# Altium schematic sheet Enconder_Part1.SchDoc
size A4
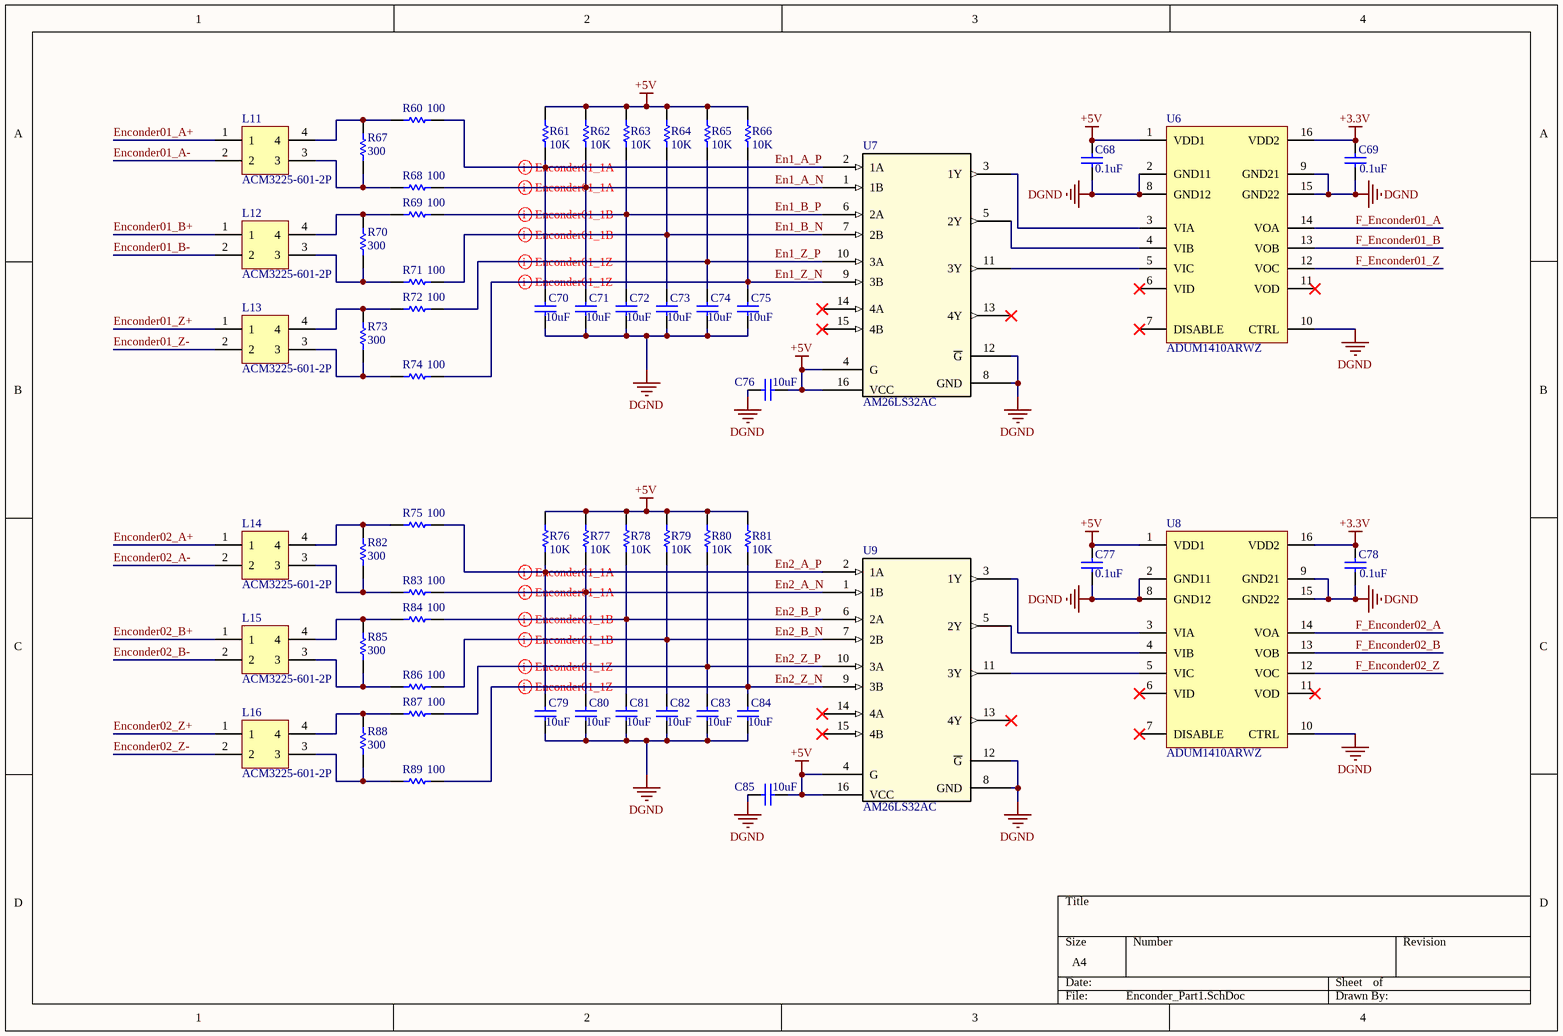
[diagram p0: Enconder_Part1.SchDoc]

## Parts
C68  value 0.1uF  [1608[0603]]  (hidden comment: Cap)
C69  value 0.1uF  [1608[0603]]  (hidden comment: Cap)
C70  value 10uF  [1608[0603]]  (hidden comment: Cap)
C71  value 10uF  [1608[0603]]  (hidden comment: Cap)
C72  value 10uF  [1608[0603]]  (hidden comment: Cap)
C73  value 10uF  [1608[0603]]  (hidden comment: Cap)
C74  value 10uF  [1608[0603]]  (hidden comment: Cap)
C75  value 10uF  [1608[0603]]  (hidden comment: Cap)
C76  value 10uF  [1608[0603]]  (hidden comment: Cap)
C77  value 0.1uF  [1608[0603]]  (hidden comment: Cap)
C78  value 0.1uF  [1608[0603]]  (hidden comment: Cap)
C79  value 10uF  [1608[0603]]  (hidden comment: Cap)
C80  value 10uF  [1608[0603]]  (hidden comment: Cap)
C81  value 10uF  [1608[0603]]  (hidden comment: Cap)
C82  value 10uF  [1608[0603]]  (hidden comment: Cap)
C83  value 10uF  [1608[0603]]  (hidden comment: Cap)
C84  value 10uF  [1608[0603]]  (hidden comment: Cap)
C85  value 10uF  [1608[0603]]  (hidden comment: Cap)
L11  ACM3225-601-2P  [ACM3225-601-2P]
L12  ACM3225-601-2P  [ACM3225-601-2P]
L13  ACM3225-601-2P  [ACM3225-601-2P]
L14  ACM3225-601-2P  [ACM3225-601-2P]
L15  ACM3225-601-2P  [ACM3225-601-2P]
L16  ACM3225-601-2P  [ACM3225-601-2P]
R60  value 100  [1608[0603]]  (hidden comment: Res1)
R61  value 10K  [1608[0603]]  (hidden comment: Res1)
R62  value 10K  [1608[0603]]  (hidden comment: Res1)
R63  value 10K  [1608[0603]]  (hidden comment: Res1)
R64  value 10K  [1608[0603]]  (hidden comment: Res1)
R65  value 10K  [1608[0603]]  (hidden comment: Res1)
R66  value 10K  [1608[0603]]  (hidden comment: Res1)
R67  value 300  [1608[0603]]  (hidden comment: Res1)
R68  value 100  [1608[0603]]  (hidden comment: Res1)
R69  value 100  [1608[0603]]  (hidden comment: Res1)
R70  value 300  [1608[0603]]  (hidden comment: Res1)
R71  value 100  [1608[0603]]  (hidden comment: Res1)
R72  value 100  [1608[0603]]  (hidden comment: Res1)
R73  value 300  [1608[0603]]  (hidden comment: Res1)
R74  value 100  [1608[0603]]  (hidden comment: Res1)
R75  value 100  [1608[0603]]  (hidden comment: Res1)
R76  value 10K  [1608[0603]]  (hidden comment: Res1)
R77  value 10K  [1608[0603]]  (hidden comment: Res1)
R78  value 10K  [1608[0603]]  (hidden comment: Res1)
R79  value 10K  [1608[0603]]  (hidden comment: Res1)
R80  value 10K  [1608[0603]]  (hidden comment: Res1)
R81  value 10K  [1608[0603]]  (hidden comment: Res1)
R82  value 300  [1608[0603]]  (hidden comment: Res1)
R83  value 100  [1608[0603]]  (hidden comment: Res1)
R84  value 100  [1608[0603]]  (hidden comment: Res1)
R85  value 300  [1608[0603]]  (hidden comment: Res1)
R86  value 100  [1608[0603]]  (hidden comment: Res1)
R87  value 100  [1608[0603]]  (hidden comment: Res1)
R88  value 300  [1608[0603]]  (hidden comment: Res1)
R89  value 100  [1608[0603]]  (hidden comment: Res1)
U6  ADUM1410ARWZ  [ADUM1410ARWZ_SOIC]
U7  AM26LS32AC  [AM26LS32AC_SOP]
U8  ADUM1410ARWZ  [ADUM1410ARWZ_SOIC]
U9  AM26LS32AC  [AM26LS32AC_SOP]

## Nets
+3.3V: C69.2 C78.2 U6.16(VDD2) U8.16(VDD2)
+5V: C68.2 C76.1 C77.2 C85.1 R61.2 R62.2 R63.2 R64.2 R65.2 R66.2 R76.2 R77.2 R78.2 R79.2 R80.2 R81.2 U6.1(VDD1) U7.4(G) U7.16(VCC) U8.1(VDD1) U9.4(G) U9.16(VCC)
DGND: C68.1 C69.1 C70.1 C71.1 C72.1 C73.1 C74.1 C75.1 C76.2 C77.1 C78.1 C79.1 C80.1 C81.1 C82.1 C83.1 C84.1 C85.2 U6.2(GND11) U6.8(GND12) U6.9(GND21) U6.10(CTRL) U6.15(GND22) U7.8(GND) U7.12(~{G}) U8.2(GND11) U8.8(GND12) U8.9(GND21) U8.10(CTRL) U8.15(GND22) U9.8(GND) U9.12(~{G})
En1_A_N: C71.2 R62.1 R68.2 U7.1(1B)
En1_A_P: C70.2 R60.2 R61.1 U7.2(1A)
En1_B_N: C73.2 R64.1 R71.2 U7.7(2B)
En1_B_P: C72.2 R63.1 R69.2 U7.6(2A)
En1_Z_N: C75.2 R66.1 R74.2 U7.9(3B)
En1_Z_P: C74.2 R65.1 R72.2 U7.10(3A)
En2_A_N: C80.2 R77.1 R83.2 U9.1(1B)
En2_A_P: C79.2 R75.2 R76.1 U9.2(1A)
En2_B_N: C82.2 R79.1 R86.2 U9.7(2B)
En2_B_P: C81.2 R78.1 R84.2 U9.6(2A)
En2_Z_N: C84.2 R81.1 R89.2 U9.9(3B)
En2_Z_P: C83.2 R80.1 R87.2 U9.10(3A)
Enconder01_A+: L11.1
Enconder01_A-: L11.2
Enconder01_B+: L12.1
Enconder01_B-: L12.2
Enconder01_Z+: L13.1
Enconder01_Z-: L13.2
Enconder02_A+: L14.1
Enconder02_A-: L14.2
Enconder02_B+: L15.1
Enconder02_B-: L15.2
Enconder02_Z+: L16.1
Enconder02_Z-: L16.2
F_Enconder01_A: U6.14(VOA)
F_Enconder01_B: U6.13(VOB)
F_Enconder01_Z: U6.12(VOC)
F_Enconder02_A: U8.14(VOA)
F_Enconder02_B: U8.13(VOB)
F_Enconder02_Z: U8.12(VOC)
NetL11_3: L11.3 R67.1 R68.1
NetL11_4: L11.4 R60.1 R67.2
NetL12_3: L12.3 R70.1 R71.1
NetL12_4: L12.4 R69.1 R70.2
NetL13_3: L13.3 R73.1 R74.1
NetL13_4: L13.4 R72.1 R73.2
NetL14_3: L14.3 R82.1 R83.1
NetL14_4: L14.4 R75.1 R82.2
NetL15_3: L15.3 R85.1 R86.1
NetL15_4: L15.4 R84.1 R85.2
NetL16_3: L16.3 R88.1 R89.1
NetL16_4: L16.4 R87.1 R88.2
NetU6_3: U6.3(VIA) U7.3(1Y)
NetU6_4: U6.4(VIB) U7.5(2Y)
NetU6_5: U6.5(VIC) U7.11(3Y)
NetU8_3: U8.3(VIA) U9.3(1Y)
NetU8_4: U8.4(VIB) U9.5(2Y)
NetU8_5: U8.5(VIC) U9.11(3Y)

Not connected (* = marked no-connect by the designer): U6 6(VID)* 7(DISABLE)* 11(VOD)*; U7 13(4Y)* 14(4A)* 15(4B)*; U8 6(VID)* 7(DISABLE)* 11(VOD)*; U9 13(4Y)* 14(4A)* 15(4B)*

## Layout directives
differential pair: En1_A_N, En1_A_P, En1_B_N, En1_B_P, En1_Z_N, En1_Z_P, En2_A_N, En2_A_P, En2_B_N, En2_B_P, En2_Z_N, En2_Z_P

## Library data of the parts
C68-C85 = Cap: Capacitor; Published: 8-Jun-2000; LatestRevisionDate: 17-Jul-2002; LatestRevisionNote: Re-released for DXP Platform.; PackageReference: RAD-0.3; Publisher: Altium Limited; PackageDescription: Radial Cap, Thru-Hole; 2 Leads; 0.3 in Pin Spacing
R60-R89 = Res1: Resistor; Published: 8-Jun-2000; LatestRevisionDate: 17-Jul-2002; LatestRevisionNote: Re-released for DXP Platform.; PackageReference: AXIAL-0.3; Publisher: Altium Limited; PackageDescription: Axial Device, Thru-Hole; 2 Leads; 0.3 in Pin Spacing